# EAGLE design doogie_bottom_board (EAGLE 9.4.2)

## Sheet 1 of 3
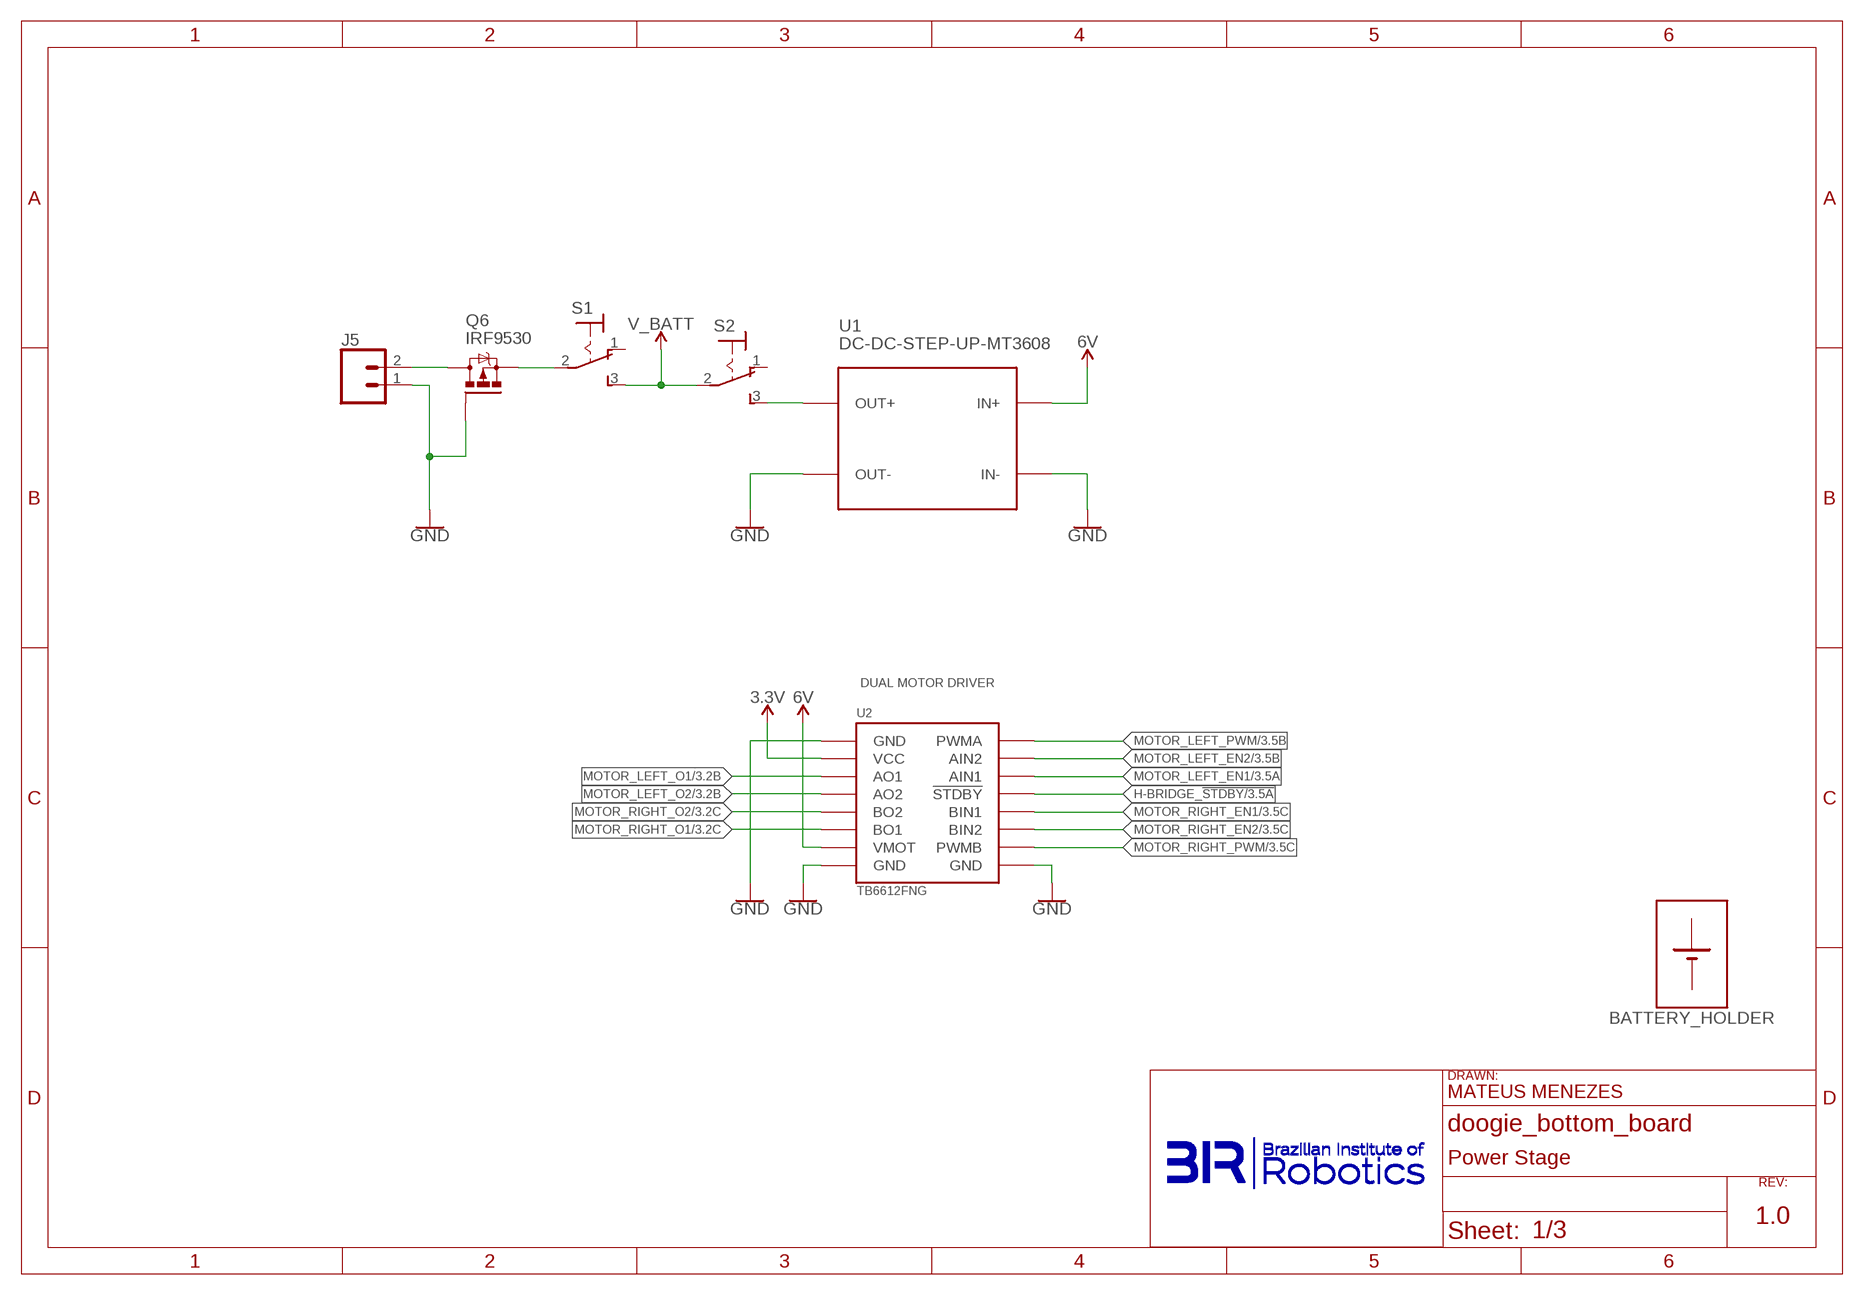
[diagram p0: schematic, sheet 1]
U$2 (FRAME_A4P): DESIGNER_NAME: MATEUS MENEZES; PAGE_DESCRIPTION: Power Stage; REV_NUMBER: 1.0

### Parts
BATTERY_HOLDER  BATTERY_HOLDER  [BATTERY_HOLDER]
J5  CONN_02JST-PTH-2  [JST-2-PTH]
Q6  IRF9530  [TO220BV]
S1  M9040P  [M9040P]
S2  M9040P  [M9040P]
U1  DC-DC-STEP-UP-MT3608  [DC-DC-STEP-UP-MT3608]
U2  TB6612FNG  [TB6612FNG]

### Nets
3.3V: U2.2(VCC) ; also sheet 2,3
6V: U1.IN+ U2.7(VMOT) ; also sheet 2,3
FILLING_POLYGON: J5.1 Q6.G U1.IN- U1.OUT- U2.1(GND) U2.8(GND) U2.16(GND) ; supply symbol labelled GND ; also sheet 2,3
H-BRIDGE_!STDBY: U2.12(!STDBY!) ; also sheet 3
MOTOR_LEFT_EN1: U2.11(AIN1) ; also sheet 3
MOTOR_LEFT_EN2: U2.10(AIN2) ; also sheet 3
MOTOR_LEFT_O1: U2.3(AO1) ; also sheet 3
MOTOR_LEFT_O2: U2.4(AO2) ; also sheet 3
MOTOR_LEFT_PWM: U2.9(PWMA) ; also sheet 3
MOTOR_RIGHT_EN1: U2.13(BIN1) ; also sheet 3
MOTOR_RIGHT_EN2: U2.14(BIN2) ; also sheet 3
MOTOR_RIGHT_O1: U2.6(BO1) ; also sheet 3
MOTOR_RIGHT_O2: U2.5(BO2) ; also sheet 3
MOTOR_RIGHT_PWM: U2.15(PWMB) ; also sheet 3
N$5: S2.3(S) U1.OUT+
N$8: J5.2 Q6.D
N$9: Q6.S S1.2(P)
V_BATT: S1.3(S) S2.2(P) ; also sheet 3
Unconnected: S1.1(O) S2.1(O)

### Notes on the sheet
- DUAL MOTOR DRIVER

## Sheet 2 of 3
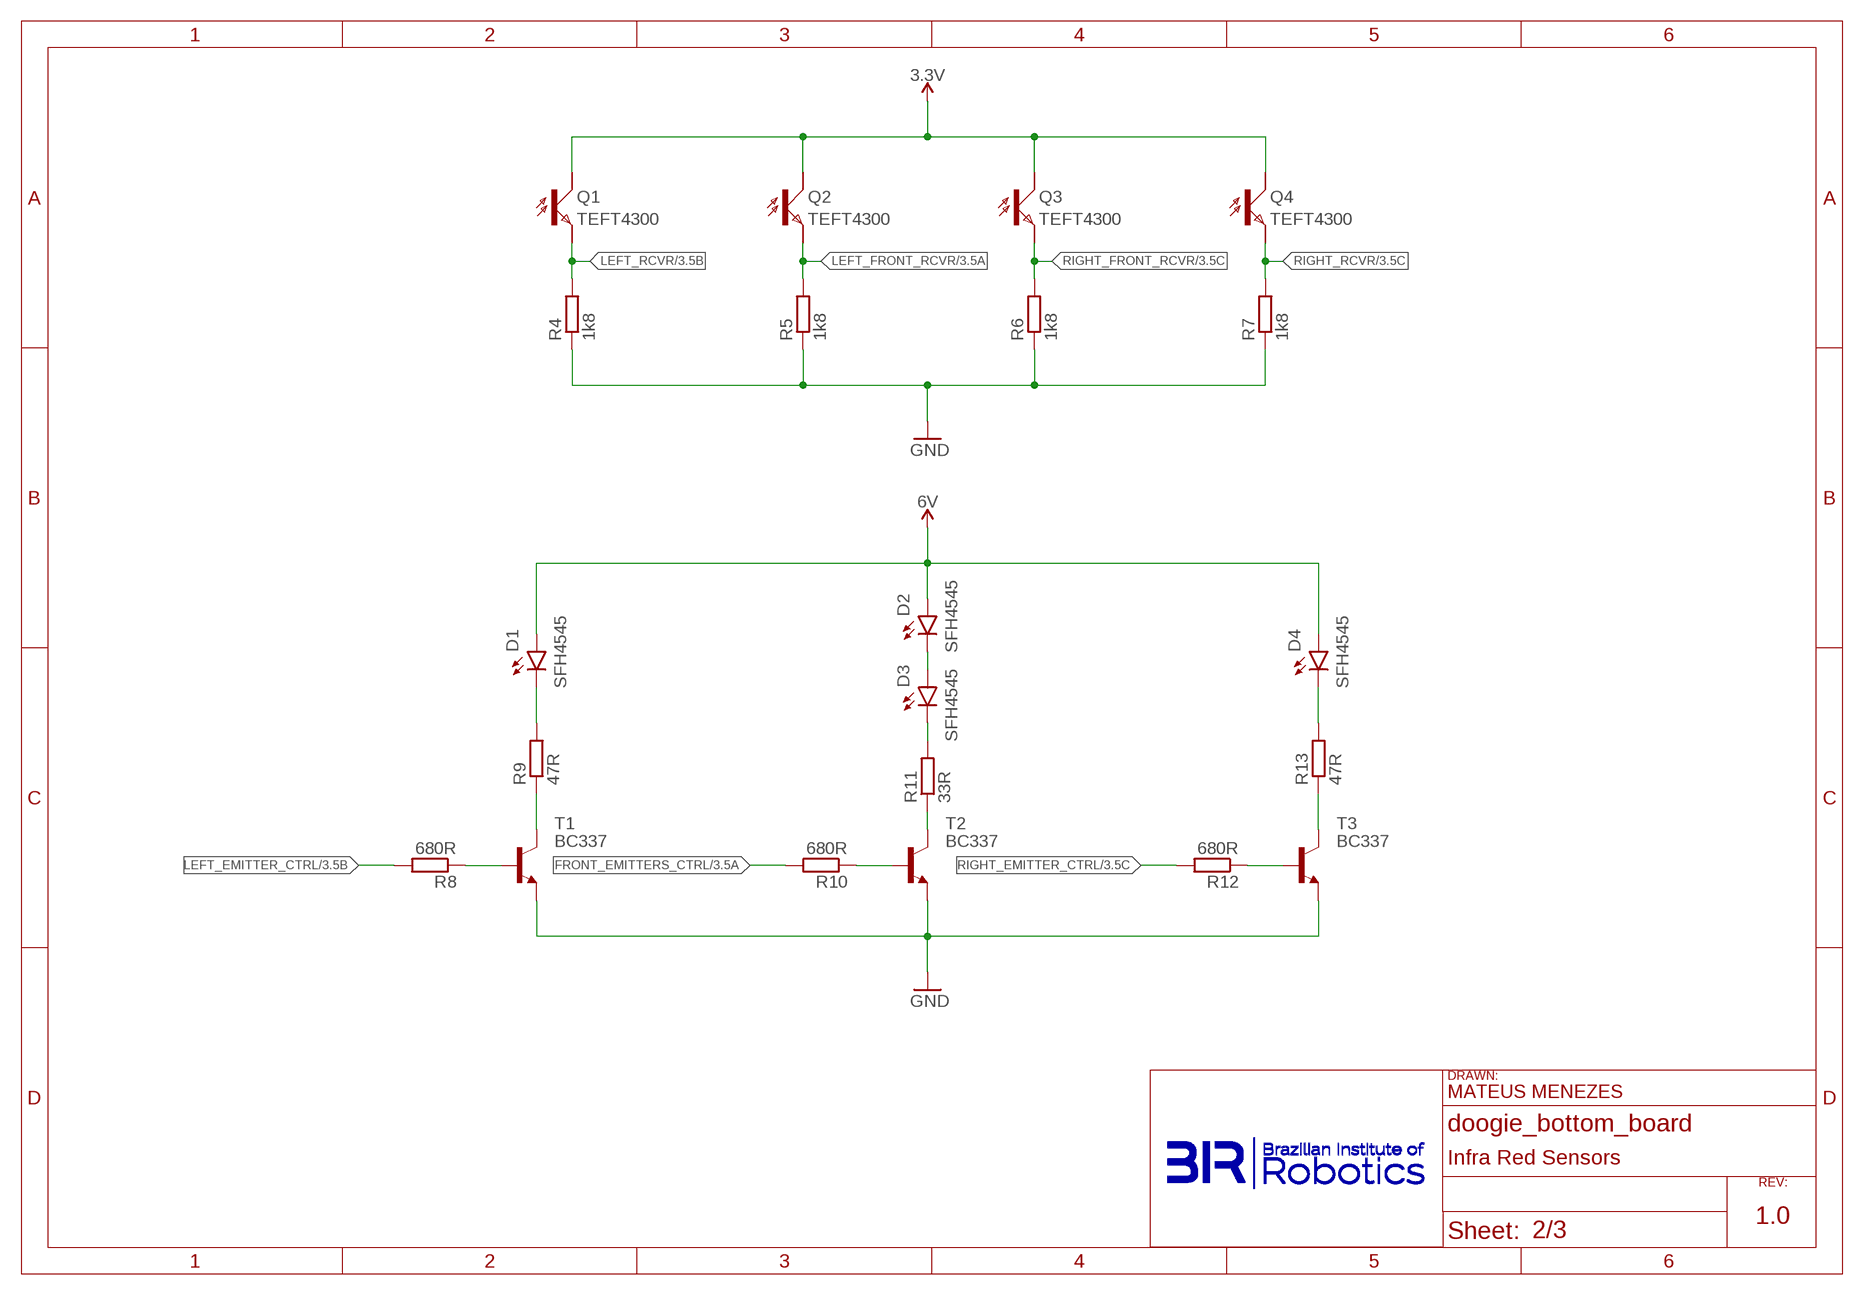
[diagram p1: schematic, sheet 2]
U$4 (FRAME_A4P): DESIGNER_NAME: MATEUS MENEZES; PAGE_DESCRIPTION: Infra Red Sensors; REV_NUMBER: 1.0

### Parts
D1  SFH4545  [SFH4545-AK]
D2  SFH4545  [SFH4545-AK]
D3  SFH4545  [SFH4545-AK]
D4  SFH4545  [SFH4545-AK]
Q1  TEFT4300  TEFT4300_5MM_RA  [TEFT_5MM_RA]
Q2  TEFT4300  TEFT4300_5MM_RA  [TEFT_5MM_RA]
Q3  TEFT4300  TEFT4300_5MM_RA  [TEFT_5MM_RA]
Q4  TEFT4300  TEFT4300_5MM_RA  [TEFT_5MM_RA]
R4  1k8  R-EU_0204/7  [0204/7]
R5  1k8  R-EU_0204/7  [0204/7]
R6  1k8  R-EU_0204/7  [0204/7]
R7  1k8  R-EU_0204/7  [0204/7]
R8  680R  R-EU_0204/7  [0204/7]
R9  47R  R-EU_0204/7  [0204/7]
R10  680R  R-EU_0204/7  [0204/7]
R11  33R  R-EU_0204/7  [0204/7]
R12  680R  R-EU_0204/7  [0204/7]
R13  47R  R-EU_0204/7  [0204/7]
T1  BC337  [TO92]
T2  BC337  [TO92]
T3  BC337  [TO92]

### Nets
3.3V: Q1.C Q2.C Q3.C Q4.C ; also sheet 1,3
6V: D1.A D2.A D4.A ; also sheet 1,3
FILLING_POLYGON: R4.1 R5.1 R6.1 R7.1 T1.1(E) T2.1(E) T3.1(E) ; supply symbol labelled GND ; also sheet 1,3
FRONT_EMITTERS_CTRL: R10.2 ; also sheet 3
LEFT_EMITTER_CTRL: R8.2 ; also sheet 3
LEFT_FRONT_RCVR: Q2.E R5.2 ; also sheet 3
LEFT_RCVR: Q1.E R4.2 ; also sheet 3
N$1: R9.1 T1.3(C)
N$2: R11.1 T2.3(C)
N$3: R13.1 T3.3(C)
N$4: R8.1 T1.2(B)
N$6: R10.1 T2.2(B)
N$7: R12.1 T3.2(B)
N$14: D2.K(C) D3.A
N$15: D1.K(C) R9.2
N$16: D4.K(C) R13.2
N$20: D3.K(C) R11.2
RIGHT_EMITTER_CTRL: R12.2 ; also sheet 3
RIGHT_FRONT_RCVR: Q3.E R6.2 ; also sheet 3
RIGHT_RCVR: Q4.E R7.2 ; also sheet 3

## Sheet 3 of 3
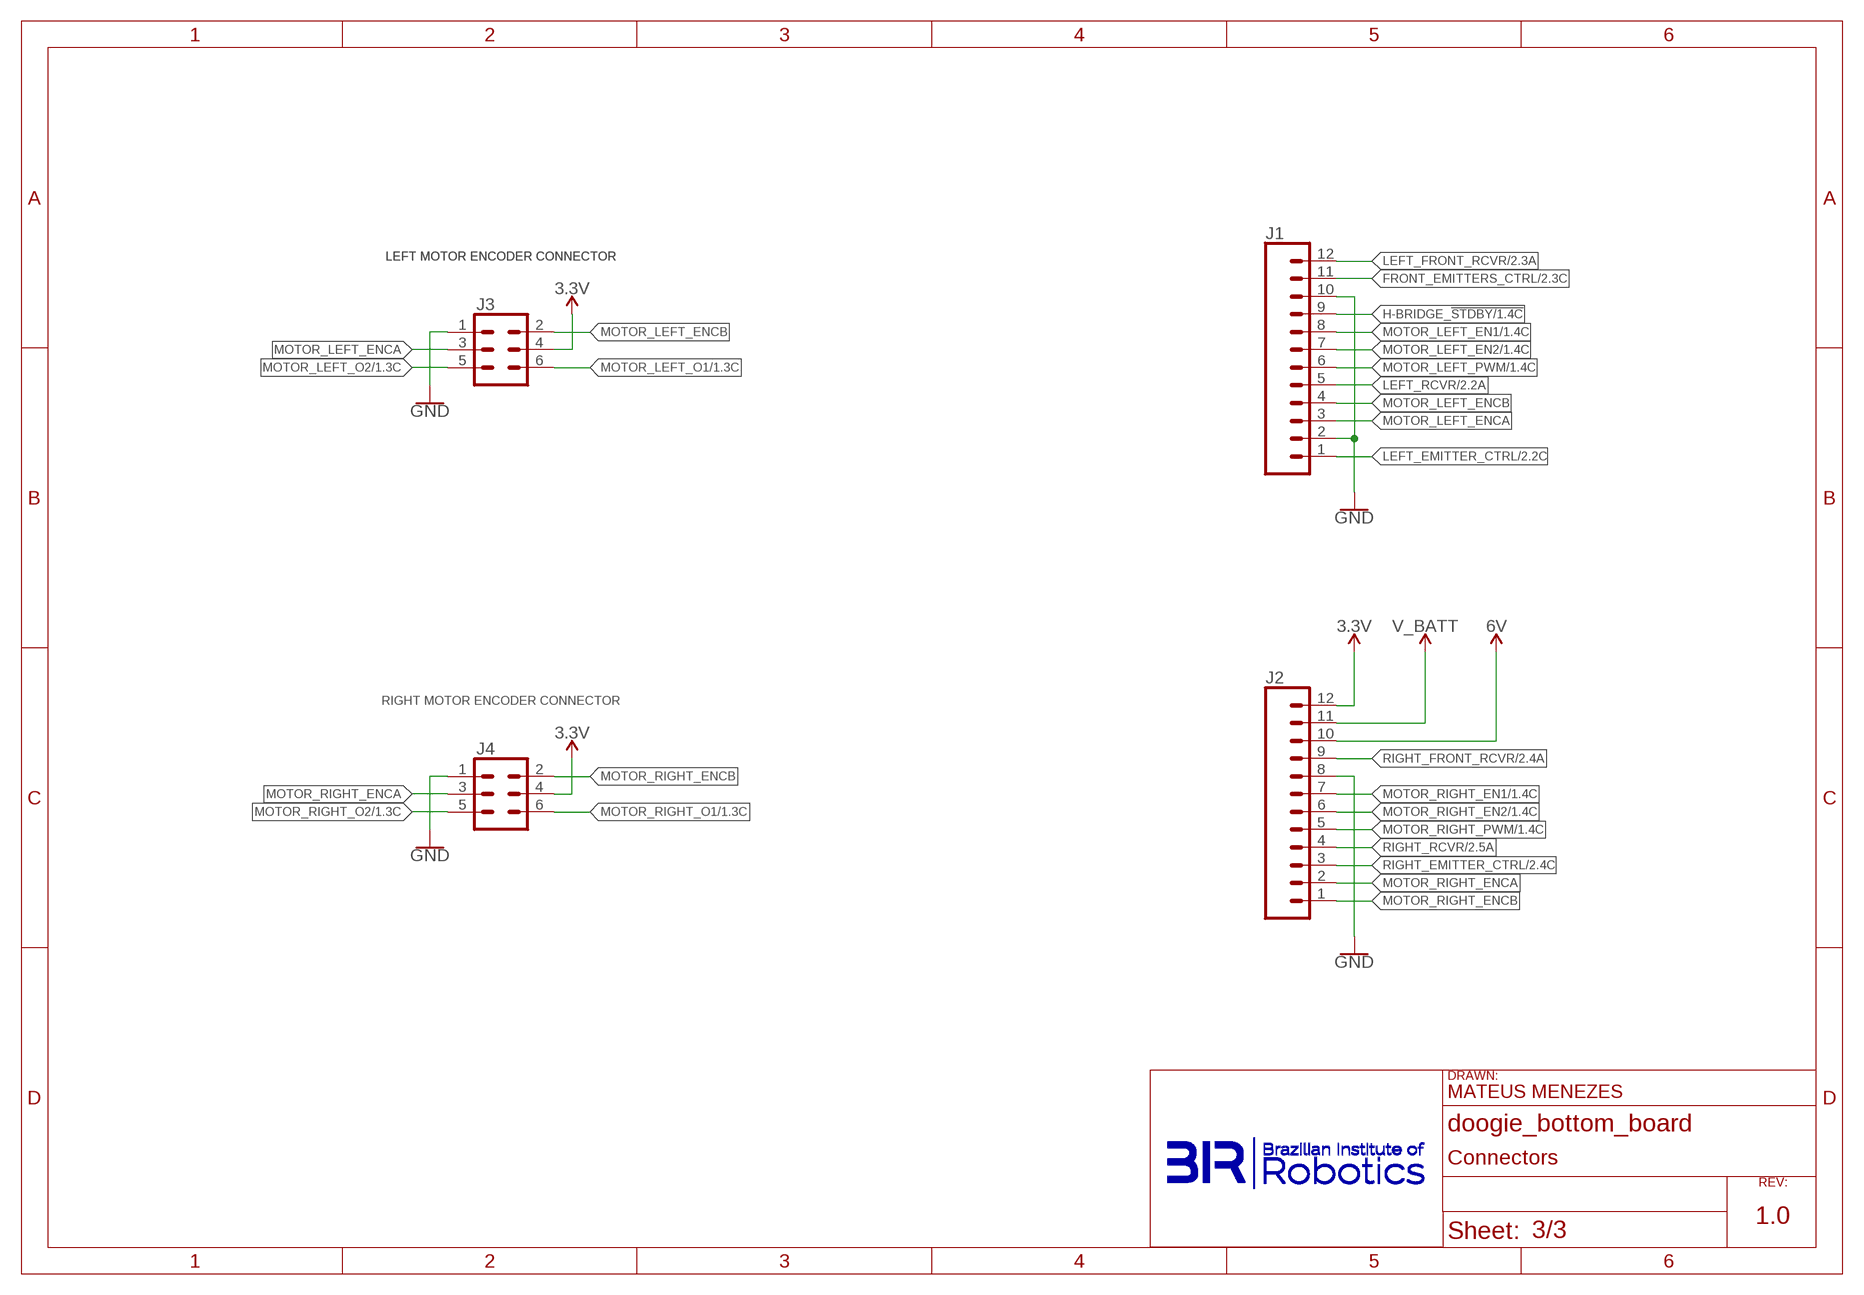
[diagram p2: schematic, sheet 3]
U$3 (FRAME_A4P): DESIGNER_NAME: MATEUS MENEZES; PAGE_DESCRIPTION: Connectors; REV_NUMBER: 1.0

### Parts
J1  CONN_12  [1X12]
J2  CONN_12  [1X12]
J3  CONN_03X2SHROUD  [2X3-SHROUDED]
J4  CONN_03X2SHROUD  [2X3-SHROUDED]

### Nets
3.3V: J2.12 J3.4 J4.4 ; also sheet 1,2
6V: J2.10 ; also sheet 1,2
FILLING_POLYGON: J1.2 J1.10 J2.8 J3.1 J4.1 ; supply symbol labelled GND ; also sheet 1,2
FRONT_EMITTERS_CTRL: J1.11 ; also sheet 2
H-BRIDGE_!STDBY: J1.9 ; also sheet 1
LEFT_EMITTER_CTRL: J1.1 ; also sheet 2
LEFT_FRONT_RCVR: J1.12 ; also sheet 2
LEFT_RCVR: J1.5 ; also sheet 2
MOTOR_LEFT_EN1: J1.8 ; also sheet 1
MOTOR_LEFT_EN2: J1.7 ; also sheet 1
MOTOR_LEFT_ENCA: J1.3 J3.3
MOTOR_LEFT_ENCB: J1.4 J3.2
MOTOR_LEFT_O1: J3.6 ; also sheet 1
MOTOR_LEFT_O2: J3.5 ; also sheet 1
MOTOR_LEFT_PWM: J1.6 ; also sheet 1
MOTOR_RIGHT_EN1: J2.7 ; also sheet 1
MOTOR_RIGHT_EN2: J2.6 ; also sheet 1
MOTOR_RIGHT_ENCA: J2.2 J4.3
MOTOR_RIGHT_ENCB: J2.1 J4.2
MOTOR_RIGHT_O1: J4.6 ; also sheet 1
MOTOR_RIGHT_O2: J4.5 ; also sheet 1
MOTOR_RIGHT_PWM: J2.5 ; also sheet 1
RIGHT_EMITTER_CTRL: J2.3 ; also sheet 2
RIGHT_FRONT_RCVR: J2.9 ; also sheet 2
RIGHT_RCVR: J2.4 ; also sheet 2
V_BATT: J2.11 ; also sheet 1

### Notes on the sheet
- LEFT MOTOR ENCODER CONNECTOR | LEFT MOTOR ENCODER CONNECTOR
- RIGHT MOTOR ENCODER CONNECTOR

## Library data of the parts
BATTERY_HOLDER = doogie:BATTERY_HOLDER
D1-D4 = doogie:SFH4545
J1 J2 = SparkFun-Connectors:CONN_12: Multi connection point. Often used as Generic Header-pin footprint for 0.1 inch spaced/style header connections On any of the 0.1 inch spaced packages, you can populate with these: Break Away Headers - Straight <https://www.sparkfun.com/products/116> (PRT-00116) Break Away Male Headers - Right Angle <https://www.sparkfun.com/products/553> (PRT-00553) Female Headers <https://www.sparkfun.com/products/115> (PRT-00115) Break Away Headers - Machine Pin <https://www.sparkfun.com/products/117> (PRT-00117) Break Away Female Headers - Swiss Machine Pin <https://www.sparkfun.com/products/743> (PRT-00743) For SCREWTERMINALS and SPRING TERMINALS visit here: Screw Terimnals on SparkFun.com <https://www.sparkfun.com/search/results?term=Screw+Terminals> (5mm/3.5mm/2.54mm spacing) This device is also useful as a general connection point to wire up your design to another part of your project. Our various solder wires solder well into these plated through hole pads. Hook-Up Wire - Assortment (Stranded, 22 AWG) <https://www.sparkfun.com/products/11375> (PRT-11375) Hook-Up Wire - Assortment (Solid Core, 22 AWG) <https://www.sparkfun.com/products/11367> (PRT-11367) View the entire wire category on our website here <https://www.sparkfun.com/categories/141> Special notes: Molex polarized connector foot print use with SKU : PRT-08231 with associated crimp pins and housings. 1MM SMD Version SKU: PRT-10208 NOTES ON THE VARIANTS LOCK and LOCK_LONGPADS... This footprint was designed to help hold the alignment of a through-hole component (i.e. 6-pin header) while soldering it into place. You may notice that each hole has been shifted either up or down by 0.005 of an inch from it's more standard position (which is a perfectly straight line). This slight alteration caused the pins (the squares in the middle) to touch the edges of the holes. Because they are alternating, it causes a "brace" to hold the component in place. 0.005 has proven to be the perfect amount of "off-center" position when using our standard breakaway headers. Although looks a little odd when you look at the bare footprint, once you have a header in there, the alteration is very hard to notice. Also,if you push a header all the way into place, it is covered up entirely on the bottom side.
J3 J4 = SparkFun-Connectors:CONN_03X2: Multi connection point. Often used as Generic Header-pin footprint for 0.1 inch spaced/style header connections You can populate with any combo of single row headers, but if you'd like an exact match, check these: Header - 2x3 (Male, 0.1") <https://www.sparkfun.com/products/12807> (PRT-12807) Header - 2x3 (Female, 0.1") <https://www.sparkfun.com/products/13010> (PRT-13010) 2x3 Pin Shrouded Header <https://www.sparkfun.com/products/10877> (PRT-10877) On any of the 0.1 inch spaced packages, you can populate with these: Break Away Headers - Straight <https://www.sparkfun.com/products/116> (PRT-00116) Break Away Male Headers - Right Angle <https://www.sparkfun.com/products/553> (PRT-00553) Female Headers <https://www.sparkfun.com/products/115> (PRT-00115) Break Away Headers - Machine Pin <https://www.sparkfun.com/products/117> (PRT-00117) Break Away Female Headers - Swiss Machine Pin <https://www.sparkfun.com/products/743> (PRT-00743) Special note: the shrouded connector mates well with our 3x2 ribbon cables: Ribbon Crimp Connector - 6-pin (2x3, Female) <https://www.sparkfun.com/products/10651> (PRT-10651) Ribbon Cable - 6 wire (15ft) <https://www.sparkfun.com/products/10646> (PRT-10646); PROD_ID: CONN-10681; SF_ID: PRT_10877
J5 = SparkFun-Connectors:CONN_02: Multi connection point. Often used as Generic Header-pin footprint for 0.1 inch spaced/style header connections On any of the 0.1 inch spaced packages, you can populate with these: Break Away Headers - Straight <https://www.sparkfun.com/products/116> (PRT-00116) Break Away Male Headers - Right Angle <https://www.sparkfun.com/products/553> (PRT-00553) Female Headers <https://www.sparkfun.com/products/115> (PRT-00115) Break Away Headers - Machine Pin <https://www.sparkfun.com/products/117> (PRT-00117) Break Away Female Headers - Swiss Machine Pin <https://www.sparkfun.com/products/743> (PRT-00743) For SCREWTERMINALS and SPRING TERMINALS visit here: Screw Terimnals on SparkFun.com <https://www.sparkfun.com/search/results?term=Screw+Terminals> (5mm/3.5mm/2.54mm spacing) This device is also useful as a general connection point to wire up your design to another part of your project. Our various solder wires solder well into these plated through hole pads. Hook-Up Wire - Assortment (Stranded, 22 AWG) <https://www.sparkfun.com/products/11375> (PRT-11375) Hook-Up Wire - Assortment (Solid Core, 22 AWG) <https://www.sparkfun.com/products/11367> (PRT-11367) View the entire wire category on our website here <https://www.sparkfun.com/categories/141> Special notes: Molex polarized connector foot print use with: PRT-08233 with associated crimp pins and housings. 2.54_SCREWTERM for use with PRT-10571. 3.5mm Screw Terminal footprints for PRT-08084 5mm Screw Terminal footprints for use with PRT-08432; PROD_ID: CONN-09863; SKU: PRT-09914
Q1-Q4 = doogie:TEFT4300_5MM_RA: TEFT4300 Right angle device 5 mm
Q6 = transistor-power:IRF9530: P-CHANNEL HEXFET POWER-MOS-FET Source: http://www.irf.com/product-info/datasheets/data/irf9530.pdf
R4-R13 = rcl:R-EU_: RESISTOR, European symbol; SPICEPREFIX: R
S1 S2 = doogie:M9040P: TOGGLE SWITCH Marquardt
T1-T3 = transistor:BC337: NPN TRANSISTOR
U1 = diy-modules:DC-DC-STEP-UP-MT3608: DC/DC Step-Up Regulator based on MT3608 chip MT3608 datasheet available here: https://www.olimex.com/Products/Breadboarding/BB-PWR-3608/resources/MT3608.pdf Click here to find device on ebay.com <http://www.ebay.com/sch/mt3608+module>
U2 = doogie:TB6612FNG: TB6612FNG Dual Motor Driver Carrier This tiny board is an easy way to use Toshiba’s TB6612FNG dual motor driver, which can independently control two bidirectional DC motors or one bipolar stepper motor. A recommended motor voltage of 4.5 V to 13.5 V and peak current output of 3 A per channel (1 A continuous) make this a great motor driver for low-power motors.

## Board
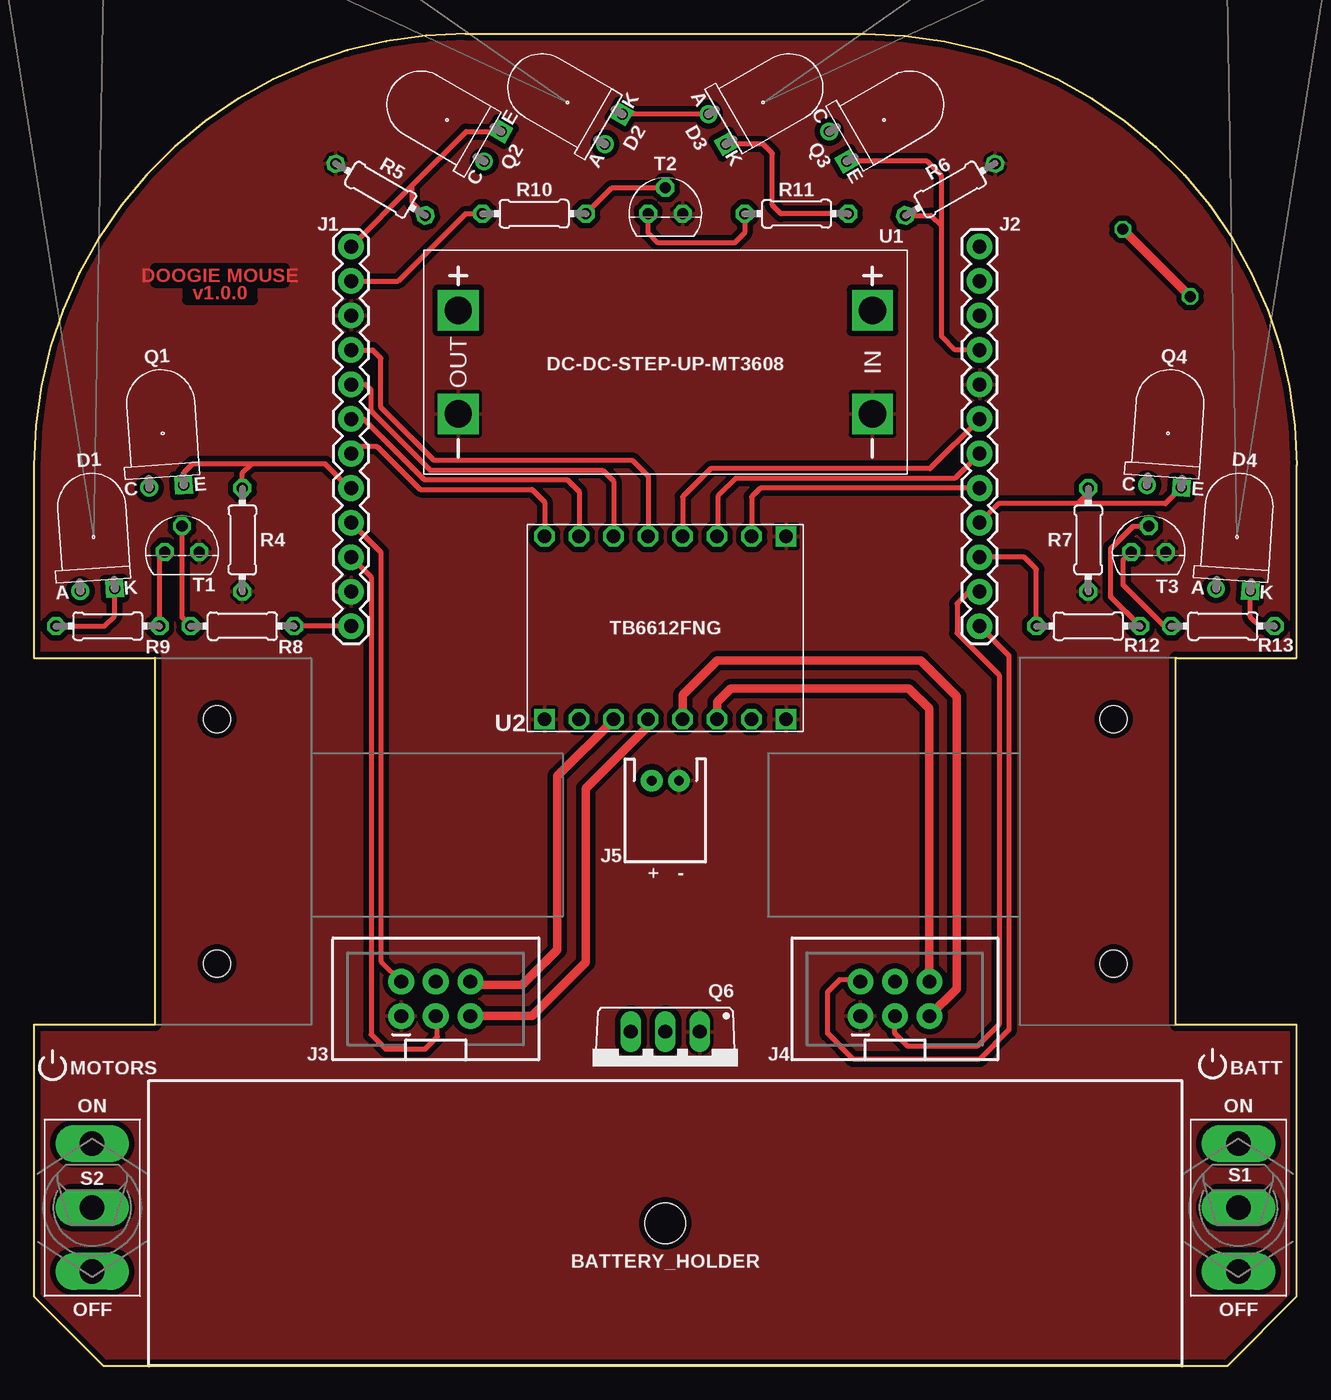
[diagram p3: board, top side]
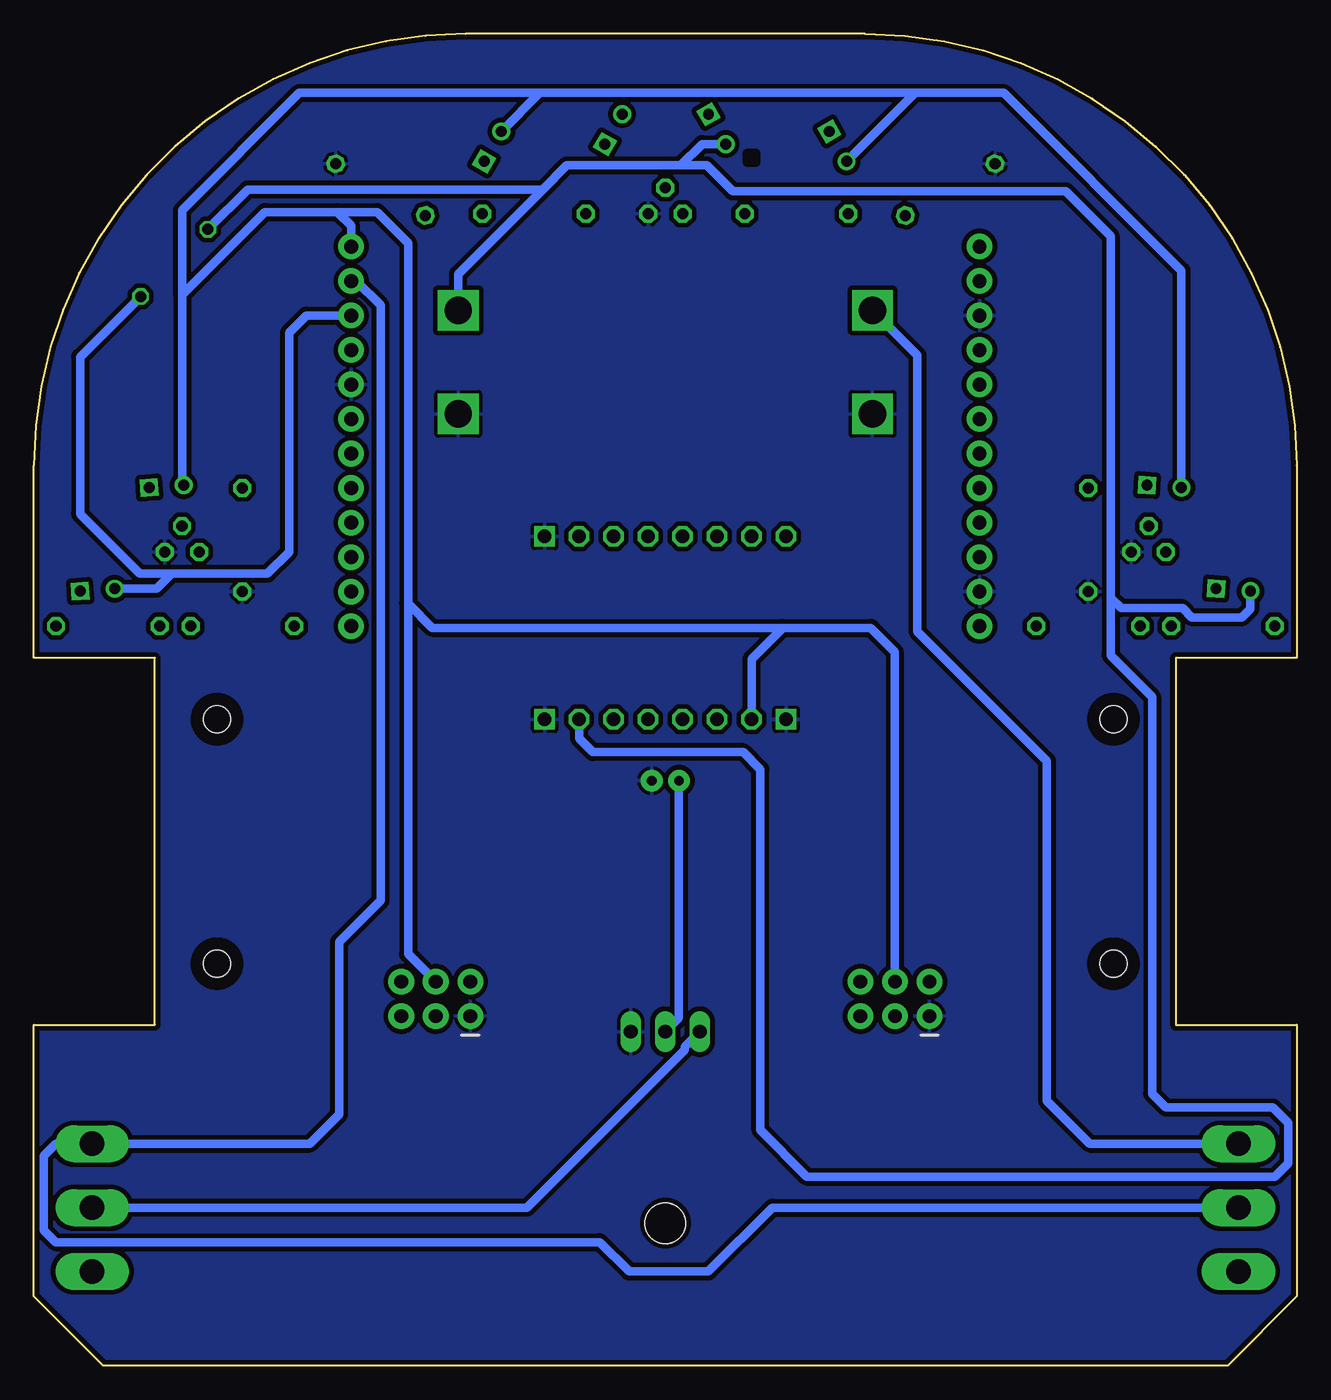
[diagram p4: board, bottom side, seen from below]

Size 92.9 x 98 mm. Coordinates in mm from the lower left corner, seen from the top.
Outline: 0,25.08 0,5.08 5.08,0 87.82,0 92.9,5.08 92.9,25.08 84.01,25.08 84.01,52.08 92.9,52.08 92.9,66.25 arc90 61.15,98 31.75,98 arc90 0,66.25 0,52.08 8.89,52.08 8.89,25.08 0,25.08
Copper layers (1*16): Top 0.035mm / dielectric 1.5mm / Bottom 0.035mm
Design rules "default *": minimum track width 8mil, minimum drill 19mil, track to track 14mil, track to pad 14mil, pad to pad 14mil, via to via 14mil, smd to smd 8mil, copper to edge 10mil, drill to drill 8mil, minimum pad ring 10mil, minimum via ring 8mil, stop-mask expansion 4mil, vias tented up to drill 20mil, thermal gap 10mil
Holes 2 mm at 13.47,47.58 13.47,29.58 79.43,29.58 79.43,47.58
bRestrict: area 12,28.2 to 14.9,31; area 12,46.2 to 14.9,49; area 78,46.2 to 80.9,49; area 78,28.2 to 80.9,31; area 39.8,88.6 to 40.4,89.2

### Footprints (pad centres in the part's own frame; a part is rotated, then mirrored left to right if it is on the bottom)
BATTERY_HOLDER = hole 3: 0,0
SFH4545-AK = drill 0.8: A -1.27,0 | drill 0.8 square: K 1.27,0
1X12 = drill 1.016 pad 1.88: 1 0,0; 2 2.54,0; 3 5.08,0; 4 7.62,0; 5 10.16,0; 6 12.7,0; 7 15.24,0; 8 17.78,0; 9 20.32,0; 10 22.86,0; 11 25.4,0; 12 27.94,0
2X3-SHROUDED = drill 1.016 pad 1.88: 1 -1.27,2.54; 2 1.27,2.54; 3 -1.27,0; 4 1.27,0; 5 -1.27,-2.54; 6 1.27,-2.54
JST-2-PTH = drill 0.7 pad 1.6: 1 -1,0; 2 1,0
TEFT_5MM_RA = drill 0.8: C -1.27,0 | drill 0.8 square: E 1.27,0
TO220BV = drill 1.016 long: D 0,-2.54; G -2.54,-2.54; S 2.54,-2.54
0204/7 = drill 0.813 octagon: 1 -3.81,0; 2 3.81,0
M9040P = drill 1.803 long: 1 0,4.699; 2 0,0; 3 0,-4.699
TO92 = drill 0.813 octagon: 1 1.27,0; 2 0,1.905; 3 -1.27,0
DC-DC-STEP-UP-MT3608 = drill 2 pad 2.8 square: IN+ 15.24,3.81; IN- 15.24,-3.81; OUT+ -15.24,3.81; OUT- -15.24,-3.81
TB6612FNG = drill 1 square: 1 -6.731,8.89; 8 -6.731,-8.89; 16 6.731,-8.89 | drill 1 octagon: 2 -6.731,6.35; 3 -6.731,3.81; 4 -6.731,1.27; 5 -6.731,-1.27; 6 -6.731,-3.81; 7 -6.731,-6.35; 9 6.731,8.89; 10 6.731,6.35; 11 6.731,3.81; 12 6.731,1.27; 13 6.731,-1.27; 14 6.731,-3.81; 15 6.731,-6.35

### Placement (x,y rotation side)
BATTERY_HOLDER  46.45,10.47 0 top
D1  4.67,57.08 4 top
D2  42.64,90.99 60 top
D3  50.26,90.99 300 top
D4  88.23,57.08 356 top
J1  23.34,54.42 90 top
J2  69.56,54.42 90 top
J3  29.56,26.98 90 top
J4  63.34,26.98 90 top
J5  46.45,43.05 180 top
Q1  9.75,64.7 4 top
Q2  33.75,89.72 60 top
Q3  59.15,89.72 300 top
Q4  83.15,64.7 356 top
Q6  46.45,22.03 180 top
R4  15.34,60.77 90 top
R5  25.5,86.55 330 top
R6  67.41,86.55 210 top
R7  77.56,60.77 90 top
R8  15.34,54.42 0 top
R9  5.43,54.42 180 top
R10  36.8,84.77 180 top
R11  56.1,84.77 0 top
R12  77.56,54.42 180 top
R13  87.47,54.42 0 top
S1  88.61,11.62 180 top
S2  4.29,11.62 180 top
T1  10.89,59.88 0 top
T2  46.45,84.77 0 top
T3  82.01,59.88 0 top
U1  46.45,73.85 0 top
U2  46.45,54.29 90 top

### Tracks (layer width: path | path; a pad name or v marks a point on that pad's centre or on a via)
3.3V
  Bottom 0.61: Q1.C 8.48,80.58 21.56,93.66 28.08,93.66 | 55.68,93.66 73.37,93.66 82.01,85.02 82.01,78.8 | 55.68,93.66 28.08,93.66 | 82.01,78.8 75.91,84.9 70.58,84.9 | Q2.C 28.08,93.66 | Q3.C 55.68,93.66 | 65.37,56.07 65.37,82.61 67.66,84.9 70.58,84.9 | 65.37,56.07 63.59,54.29 37.81,54.29 | J3.4 29.56,52.51 31.34,54.29 37.81,54.29 | J2.12 69.56,83.88 70.58,84.9 | U2.2 40.1,52 37.81,54.29 | 65.37,56.07 65.37,30.29 J4.4 | 82.01,78.8 82.01,64.92 Q4.C
6V  (via drill 0.81)
  Top 0.61: v80.11,83.63 v85.06,78.67
  Bottom 0.61: U1.IN+ 61.69,80.32 55.47,86.55 | 55.47,86.55 53.69,88.33 45.31,88.33 | 45.31,88.33 43.4,88.33 41.5,86.42 16.99,86.42 13.68,83.12 13.68,56.5 | D1.A 3.4,55.68 4.03,55.05 7.72,55.05 8.4,55.74 12.92,55.74 13.68,56.5 | 13.68,56.5 13.68,52.26 10.64,49.21 10.64,20 9.62,18.98 1.75,18.98 0.64,17.87 0.64,14.89 1.62,13.9 36.04,13.9 39.47,17.33 39.47,43.88 40.73,45.15 51.78,45.15 52.8,46.16 U2.7 | 55.47,86.55 77.18,86.55 v80.11,83.63 | v85.06,78.67 89.5,74.23 89.5,62.67 85.11,58.28 82.77,58.28 | J2.10 72.87,77.28 74.14,76.01 74.14,59.88 75.74,58.28 82.77,58.28 | D4.A 83.88,57.17 82.77,58.28 | 45.31,88.33 43.74,89.89 D2.A
FILLING_POLYGON
  pour Top (isolate 0.406): 0,25.08 0,5.08 5.08,0 87.82,0 92.9,5.08 92.9,25.08 84.01,25.08 84.01,52.08 92.9,52.08 92.9,66.25 arc90 61.15,98 31.75,98 arc90 0,66.25 0,52.08 8.89,52.08 8.89,25.08
  pour Bottom (isolate 0.356): 0,25.08 0,5.08 5.08,0 87.82,0 92.9,5.08 92.9,25.08 84.01,25.08 84.01,52.08 92.9,52.08 92.9,66.25 arc90 61.15,98 31.75,98 arc90 0,66.25 0,52.08 8.89,52.08 8.89,25.08
  pour Bottom (isolate 0.356, rank 2): 5.05,0.06 -0.03,5.14 -0.03,25.08 92.93,25.08 92.93,5.14 87.85,0.06
FRONT_EMITTERS_CTRL
  Top 0.356: J1.11 26.8,79.82 31.75,84.77 R10.2
H-BRIDGE_!STDBY
  Top 0.356: U2.12 45.18,65.47 44.04,66.61 29.43,66.61 25.52,70.52 25.52,74.13 24.91,74.74 J1.9
LEFT_EMITTER_CTRL
  Top 0.356: J1.1 R8.2
LEFT_FRONT_RCVR
  Top 0.356: J1.12 27.85,86.87 | 27.85,86.87 31.8,90.82 Q2.E | R5.2 27.85,85.59 27.85,86.87
LEFT_RCVR
  Top 0.356: J1.5 23.21,64.58 21.43,66.35 15.97,66.35 | 15.97,66.35 11.65,66.35 11.01,65.72 Q1.E | R4.2 15.34,65.72 15.97,66.35
MOTOR_LEFT_EN1
  Top 0.356: U2.11 42.64,65.08 41.83,65.9 29.14,65.9 24.81,70.23 24.81,71.79 24.4,72.2 J1.8
MOTOR_LEFT_EN2
  Top 0.356: U2.10 40.1,64.32 39.24,65.19 28.72,65.19 24.25,69.66 J1.7
MOTOR_LEFT_ENCA
  Top 0.356: J1.3 24.81,58.02 24.81,24.37 25.88,23.3 28.8,23.3 29.69,24.19 29.69,25.59 J3.3
MOTOR_LEFT_ENCB
  Top 0.356: J1.4 25.52,59.85 25.52,29.75 J3.2
MOTOR_LEFT_O1
  Top 0.61: U2.3 42.64,47.53 38.5,43.39 38.5,30.59 35.91,28 32.35,28 J3.6
MOTOR_LEFT_O2
  Top 0.61: U2.4 45.18,47.05 40.61,42.48 40.61,29.65 36.67,25.71 J3.5
MOTOR_LEFT_PWM
  Top 0.356: J1.6 23.84,67.62 25.27,67.62 28.42,64.47 36.65,64.47 37.56,63.56 U2.9
MOTOR_RIGHT_EN1
  Top 0.356: J2.7 65.91,66 49.78,66 47.72,63.94 U2.13
MOTOR_RIGHT_EN2
  Top 0.356: J2.6 67.73,65.29 51.62,65.29 50.31,63.98 50.31,61.07 U2.14
MOTOR_RIGHT_ENCA
  Top 0.356: J2.2 68.8,56.96 67.91,56.07 67.91,53.91 71.01,50.81 71.01,25.12 69.4,23.5 64.28,23.5 63.34,24.44 J4.3
MOTOR_RIGHT_ENCB
  Top 0.356: J2.1 71.72,52.26 71.72,24.7 69.56,22.54 60.29,22.54 58.39,24.44 58.39,27.49 59.28,28.38 60.67,28.38 J4.2
MOTOR_RIGHT_O1
  Top 0.61: U2.6 50.26,48.83 51.28,49.84 64.36,49.84 65.86,48.35 65.86,28.28 J4.6
MOTOR_RIGHT_O2
  Top 0.61: U2.5 47.72,49.34 50.26,51.88 65.25,51.88 67.89,49.23 67.89,27.72 J4.5
MOTOR_RIGHT_PWM
  Top 0.356: J2.5 53.44,64.58 52.8,63.94 U2.15
N$1
  Top 0.356: R9.1 9.24,59.5 T1.3
N$2
  Top 0.356: R11.1 52.29,83.37 51.53,82.61 45.94,82.61 45.18,83.37 T2.3
N$3
  Top 0.356: R13.1 83.15,54.42 80.11,57.46 80.11,59.24 T3.3
N$4
  Top 0.356: R8.1 10.89,55.05 T1.2
N$5
  Bottom 0.61: S2.3 15.21,16.32 18.38,19.49 18.38,44.51 27.91,54.04 27.91,74.36 U1.OUT+
N$6
  Top 0.356: R10.1 42.51,86.67 T2.2
N$7
  Top 0.356: R12.1 79.22,56.58 79.22,60.13 80.87,61.78 T3.2
N$8
  Bottom 0.61: J5.2 45.45,25.57 Q6.D
N$9
  Bottom 0.61: Q6.S 45.03,23.45 45.03,23.22 56.63,11.62 S1.2
N$14
  Top 0.356: D3.A D2.K
N$15
  Top 0.356: R9.2 5.18,54.42 5.94,55.18 D1.K
N$16
  Top 0.356: R13.2 90.14,54.42 89.5,55.05 D4.K
N$20
  Top 0.356: R11.2 54.96,84.77 54.32,85.41 54.32,89.22 53.65,89.89 D3.K
RIGHT_EMITTER_CTRL
  Top 0.356: R12.2 73.75,58.61 72.87,59.5 J2.3
RIGHT_FRONT_RCVR
  Top 0.356: J2.9 67.79,74.74 66.77,75.75 66.77,83.88 | 66.77,83.88 66.77,87.56 65.71,88.62 Q3.E | R6.2 66.01,84.64 66.77,83.88
RIGHT_RCVR
  Top 0.356: Q4.E 83.24,63.43 76.8,63.43 | J2.4 70.96,63.43 76.8,63.43 | R7.2 77.56,64.2 76.8,63.43
V_BATT
  Bottom 0.61: J2.11 69.18,79.82 67.41,78.04 67.41,34.22 70.45,31.18 70.45,18.48 72.61,16.32 S1.3 91.28,16.32 92.17,15.43 92.17,9.97 91.28,9.08 51.28,9.08 49.12,6.92 43.28,6.92 38.58,11.62 S2.2

### Text on the board
Top: DOOGIE MOUSE | v1.0.0
tNames: + | - | MOTORS | BATT | ON | ON | OFF | OFF
tStop: DOOGIE MOUSE | v1.0.0
tDocu: DOOGIE MOUSE V1.0 by Doogie Team / Licensed under CERN OHL v.1.2. / http://ohwr.org/cernohl | MOTOR_LEFT | /home/menezes/Pictures/power-button-off.bmp | MOTOR_RIGHT